# EAGLE design pcbmlf (EAGLE 9.6.2)
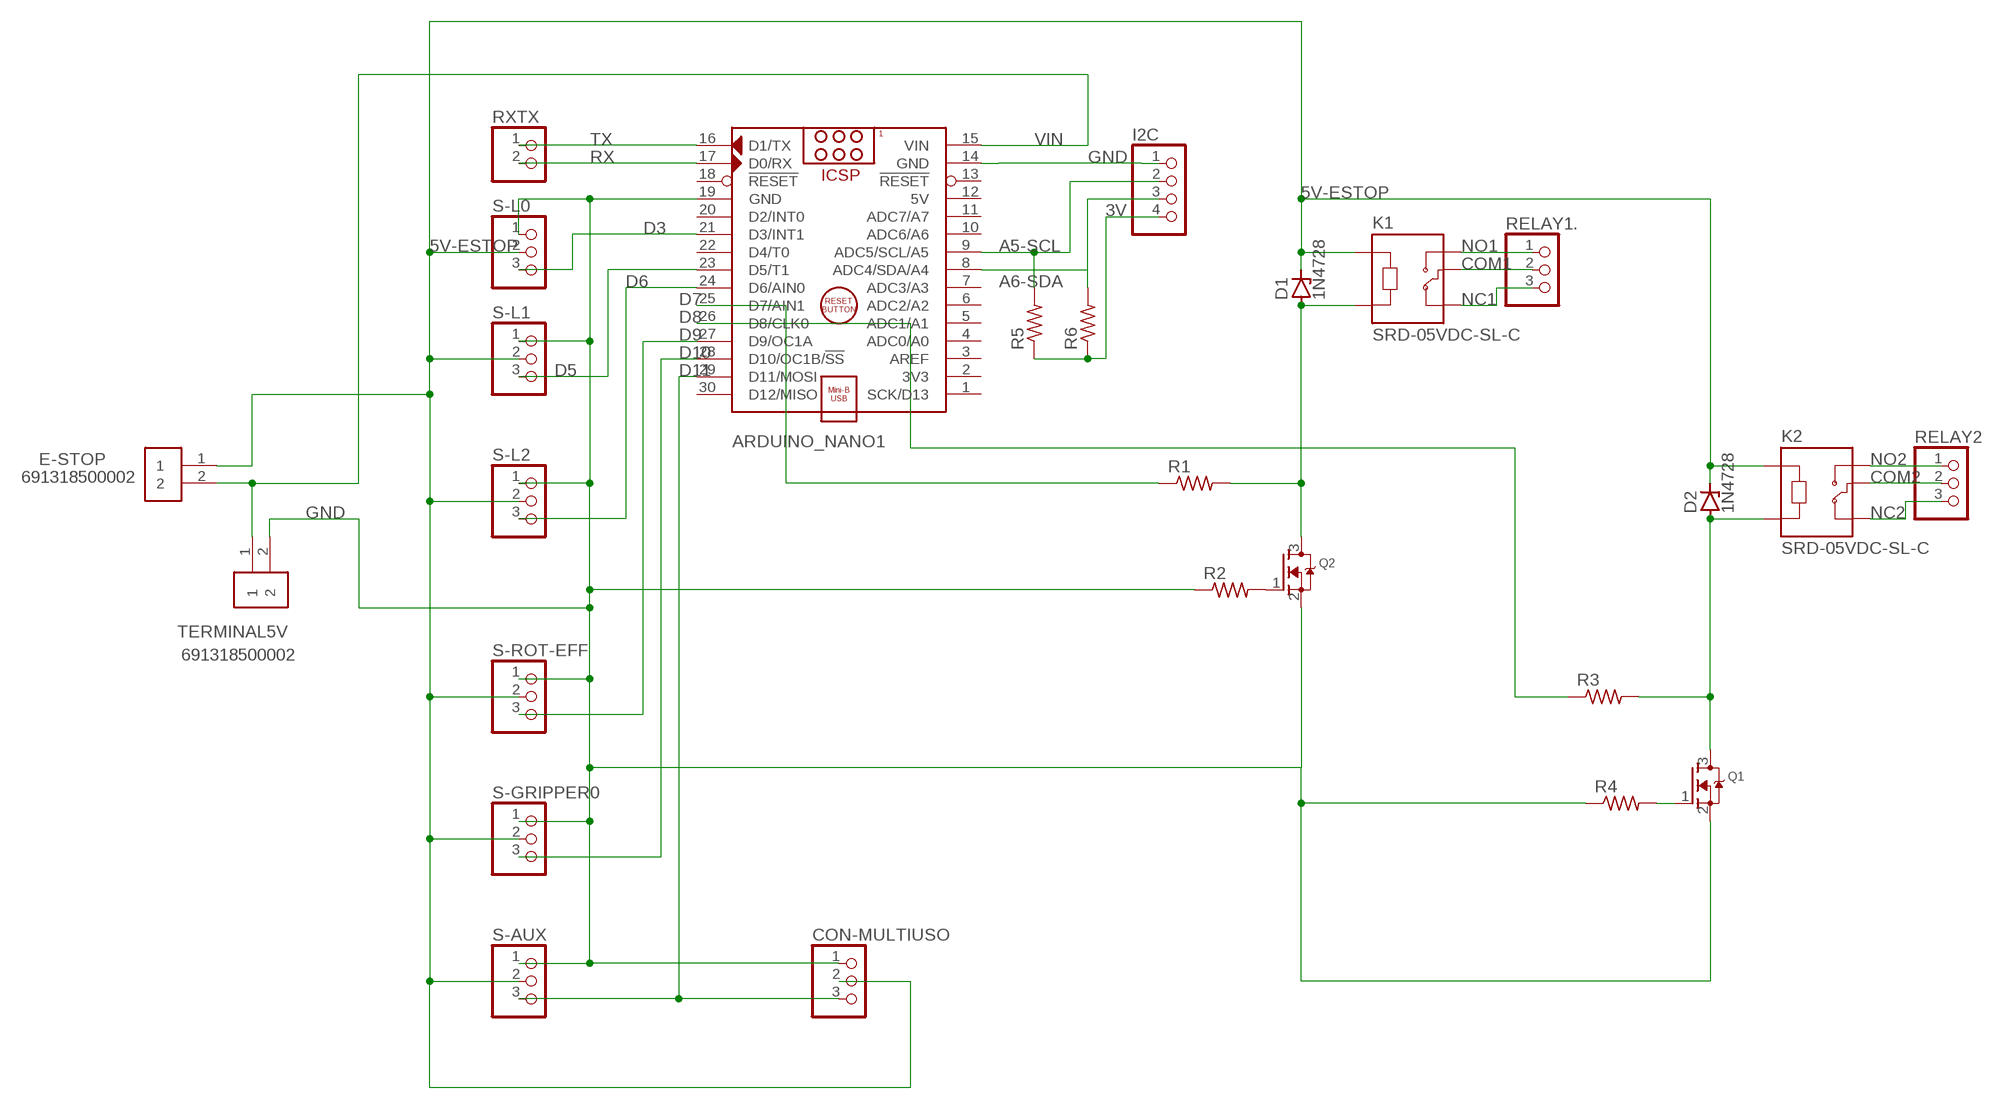
[diagram p0: schematic, sheet 1]

## Parts
ARDUINO_NANO1  ARDUINO_NANO  [ARDUINO_NANO]
CON-MULTIUSO  PINHD-1X3  [1X03]
D1  1N4728  [DO41Z10]
D2  1N4728  [DO41Z10]
E-STOP  691318500002  [TERMINALBLOCK_PLUGGABLE-2-5.08MM]
I2C  PINHD-1X4  [1X04]
K1  SRD-05VDC-SL-C  [RELAY_SRD-05VDC-SL-C]
K2  SRD-05VDC-SL-C  [RELAY_SRD-05VDC-SL-C]
Q1  MOSFET-NWAVE  [SOT23-W]
Q2  MOSFET-NWAVE  [SOT23-W]
R1  R-US_R0805  [R0805]
R2  R-US_R0805  [R0805]
R3  R-US_R0805  [R0805]
R4  R-US_R0805  [R0805]
R5  R-US_R0805  [R0805]
R6  R-US_R0805  [R0805]
RELAY1.  PINHD-1X3  [1X03]
RELAY2  PINHD-1X3  [1X03]
RXTX  PINHD-1X2  [1X02]
S-AUX  PINHD-1X3  [1X03]
S-GRIPPER0  PINHD-1X3  [1X03]
S-L0  PINHD-1X3  [1X03]
S-L1  PINHD-1X3  [1X03]
S-L2  PINHD-1X3  [1X03]
S-ROT-EFF  PINHD-1X3  [1X03]
TERMINAL5V  691318500002  [TERMINALBLOCK_PLUGGABLE-2-5.08MM]

## Nets
3V: I2C.4 R5.1 R6.1
5V-ESTOP: CON-MULTIUSO.2 D1.C D2.C E-STOP.1 K1.A1 K2.A1 S-AUX.2 S-GRIPPER0.2 S-L0.2 S-L1.2 S-L2.2 S-ROT-EFF.2
A5-SCL: ARDUINO_NANO1.9(ADC5/SCL/A5) I2C.2 R5.2
A6-SDA: ARDUINO_NANO1.8(ADC4/SDA/A4) I2C.3 R6.2
COM1: K1.COM RELAY1..2
COM2: K2.COM RELAY2.2
D3: ARDUINO_NANO1.21(D3/INT1) S-L0.3
D5: ARDUINO_NANO1.23(D5/T1) S-L1.3
D6: ARDUINO_NANO1.24(D6/AIN0) S-L2.3
D7: ARDUINO_NANO1.25(D7/AIN1) R1.1
D8: ARDUINO_NANO1.26(D8/CLK0) R3.1
D9: ARDUINO_NANO1.27(D9/OC1A) S-ROT-EFF.3
D10: ARDUINO_NANO1.28(D10/OC1B/!SS) S-GRIPPER0.3
D11: ARDUINO_NANO1.29(D11/MOSI) CON-MULTIUSO.3 S-AUX.3
GND: ARDUINO_NANO1.14(GND) ARDUINO_NANO1.19(GND) CON-MULTIUSO.1 I2C.1 Q1.2(S) Q2.2(S) R2.1 R4.1 S-AUX.1 S-GRIPPER0.1 S-L0.1 S-L1.1 S-L2.1 S-ROT-EFF.1 TERMINAL5V.2
N$8: Q2.1(G) R2.2
N$12: Q1.1(G) R4.2
N$13: D1.A K1.A2 Q2.3(D) R1.2
N$14: D2.A K2.A2 Q1.3(D) R3.2
NC1: K1.NC RELAY1..3
NC2: K2.NC RELAY2.3
NO1: K1.NO RELAY1..1
NO2: K2.NO RELAY2.1
RX: ARDUINO_NANO1.17(D0/RX) RXTX.2
TX: ARDUINO_NANO1.16(D1/TX) RXTX.1
VIN: ARDUINO_NANO1.15(VIN) E-STOP.2 TERMINAL5V.1
Unconnected: ARDUINO_NANO1.1(SCK/D13) ARDUINO_NANO1.2(3V3) ARDUINO_NANO1.3(AREF) ARDUINO_NANO1.4(ADC0/A0) ARDUINO_NANO1.5(ADC1/A1) ARDUINO_NANO1.6(ADC2/A2) ARDUINO_NANO1.7(ADC3/A3) ARDUINO_NANO1.10(ADC6/A6) ARDUINO_NANO1.11(ADC7/A7) ARDUINO_NANO1.13(!RESET) ARDUINO_NANO1.18(!RESET) ARDUINO_NANO1.20(D2/INT0) ARDUINO_NANO1.22(D4/T0) ARDUINO_NANO1.30(D12/MISO)

## Power pins joined to a net without a drawn wire
5V: ARDUINO_NANO1.12(5V)

## Library data of the parts
ARDUINO_NANO1 = ArduinoNanoV30:ARDUINO_NANO: Arduino Nano V3.0 Module Overview: The Arduino Nano is a small, complete, and breadboard-friendly board based on the ATmega328 (Arduino Nano 3.x) or ATmega168 (Arduino Nano 2.x). It has more or less the same functionality of the Arduino Duemilanove, but in a different package. It lacks only a DC power jack, and works with a Mini-B USB cable instead of a standard one. The Nano was designed and is being produced by Gravitech <http://www.gravitech.us/arna30wiatp.html>. General specifications: Item Value Microcontroller Atmel ATmega168 or ATmega328 Operating Voltage (logic level) 5 V Input Voltage (recommended) 7-12 V Input Voltage (limits) 6-20 V Digital I/O Pins 14 (of which 6 provide PWM output) Analog Input Pins 8 DC Current per I/O Pin 40 mA Flash Memory 16 KB (ATmega168) or 32 KB (ATmega328) of which 2 KB used by bootloader SRAM 1 KB (ATmega168) or 2 KB (ATmega328) EEPROM 512 bytes (ATmega168) or 1 KB (ATmega328) Clock Speed 16 MHz Dimensions (Inches) 0.73" x 1.70" Dimensions (mm) 18mm x 45mm Overall height About 9 mm (not including pins) Weigth 5 g Power: The Arduino Nano can be powered via the Mini-B USB connection, 6-20V unregulated external power supply (pin 30), or 5V regulated external power supply (pin 27). The power source is automatically selected to the highest voltage source. Memory: The ATmega168 has 16 KB of flash memory for storing code (of which 2 KB is used for the bootloader); the ATmega328 has 32 KB, (also with 2 KB used for the bootloader). The ATmega168 has 1 KB of SRAM and 512 bytes of EEPROM (which can be read and written with the EEPROM library); the ATmega328 has 2 KB of SRAM and 1 KB of EEPROM. Input and Output: Each of the 14 digital pins on the Nano can be used as an input or output, using pinMode(), digitalWrite(), and digitalRead() functions. They operate at 5 volts. Each pin can provide or receive a maximum of 40 mA and has an internal pull-up resistor (disconnected by default) of 20-50 kOhms. In addition, some pins have specialized functions. Visit Arduino - ArduinoBoardNano <https://www.arduino.cc/en/Main/ArduinoBoardNano>
CON-MULTIUSO RELAY1. RELAY2 S-AUX S-GRIPPER0 S-L0 S-L1 S-L2 S-ROT-EFF = pinhead:PINHD-1X3: PIN HEADER
D1 D2 = diode:1N4728: Z DIODE 3.3 V, 1W, 5 percent
E-STOP TERMINAL5V = Terminal Blocks:691318500002: 5.08MM CLOSE VERTICAL PCB HEADER WITH FLANGES WR-TBL Manufacturer's datasheet <https://katalog.we-online.com/em/datasheet/6913185000xx.pdf>; CREATED_BY: PCBLayout.com; MANUFACTURER: WURTH ELEKTRONIK; MPN: 691318500002
I2C = pinhead:PINHD-1X4: PIN HEADER
K1 = SRD-05VDC-SL-C:SRD-05VDC-SL-C: 5V Trigger Relay Module For Arduino And Raspberry Pi 5V Trigger Relay Module For Arduino And Raspberry Pi Check availability <https://pricing.snapeda.com/parts/SRD-05VDC-SL-C/Songle%20Relay/view-part?ref=eda>; AVAILABILITY: Not in stock; DESCRIPTION: 5V Trigger Relay Module For Arduino And Raspberry Pi 5V Trigger Relay Module For Arduino And Raspberry Pi; MF: Songle Relay; MP: SRD-05VDC-SL-C; PACKAGE: NON STANDARD-5 Songle Relay; PRICE: None
K2 = SRD-05VDC-SL-C:SRD-05VDC-SL-C: 5V Trigger Relay Module For Arduino And Raspberry Pi 5V Trigger Relay Module For Arduino And Raspberry Pi Check availability <https://pricing.snapeda.com/parts/SRD-05VDC-SL-C/Songle%20Relay/view-part?ref=eda>; AVAILABILITY: Not in stock; DESCRIPTION: 5V Trigger Relay Module For Arduino And Raspberry Pi 5V Trigger Relay Module For Arduino And Raspberry Pi; MF: Songle Relay; MP: SRD-05VDC-SL-C; PACKAGE: NON STANDARD-5 Songle Relay; PRICE: None; SPICEPREFIX: X
Q1 Q2 = adafruit:MOSFET-N: N-Channel Mosfet 2N7002E - 60V 260mA SOT23 [Digikey: 2N7002ET1GOSTR-ND] - REEL BSH103 - 30V 850mA SOT23 [Digikey: 568-5013-1-ND]
R1-R6 = rcl:R-US_: RESISTOR, American symbol; SPICEPREFIX: R
RXTX = pinhead:PINHD-1X2: PIN HEADER

## Net classes
0 default: width 0.508 mm

## Board
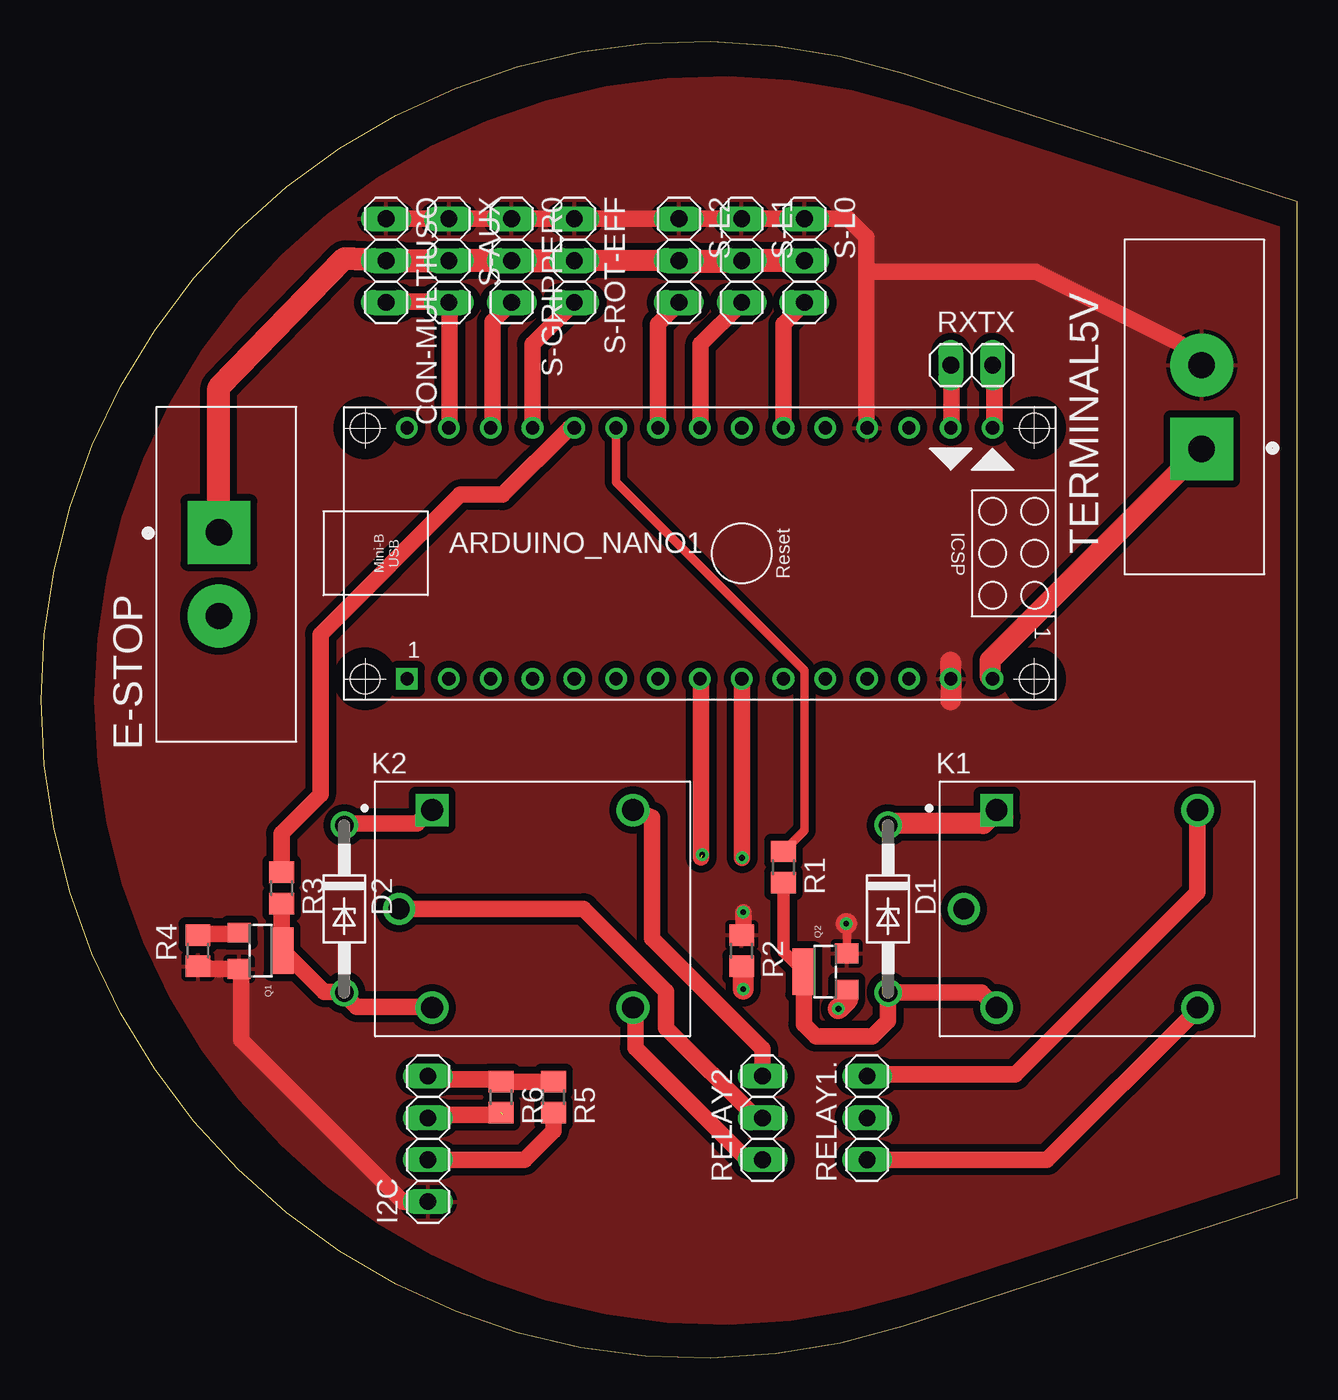
[diagram p1: board, top side]
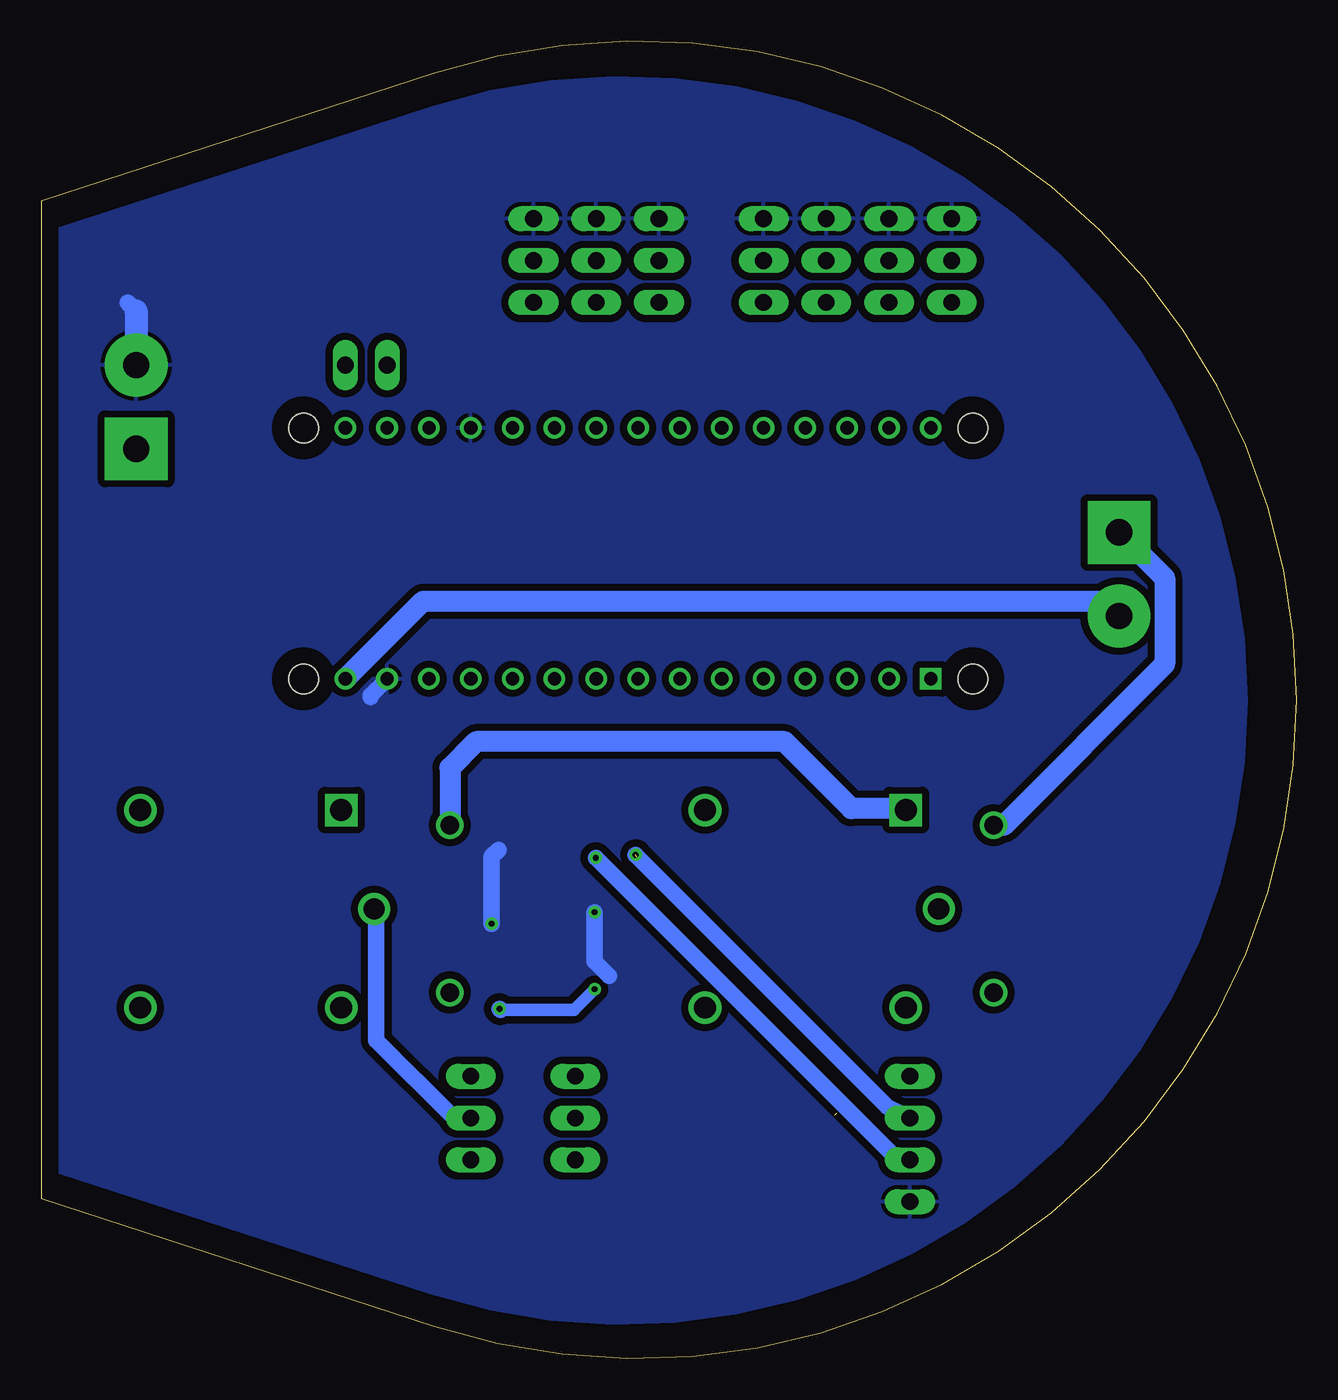
[diagram p2: board, bottom side, seen from below]

Size 76.25 x 79.99 mm. Coordinates in mm from the lower left corner, seen from the top.
Outline: 52.36,78.04 76.25,70.27 76.25,9.71 52.36,1.95 arc-216 52.36,78.04
Copper layers (1*16): Top 0.035mm / dielectric 1.5mm / Bottom 0.035mm
Design rules "default *": minimum track width 20mil, minimum drill 0.35mm, track to track 6mil, track to pad 6mil, pad to pad 6mil, via to via 6mil, smd to smd 6mil, copper to edge 40mil, drill to drill 6mil, minimum pad ring 10mil, minimum via ring 8mil, stop-mask expansion 4mil, vias tented up to drill 0mil, thermal gap 10mil

### Footprints (pad centres in the part's own frame; a part is rotated, then mirrored left to right if it is on the bottom)
ARDUINO_NANO = drill 0.8 square: 1 -20.32,-7.62 | drill 0.8: 2 -17.78,-7.62; 3 -15.24,-7.62; 4 -12.7,-7.62; 5 -10.16,-7.62; 6 -7.62,-7.62; 7 -5.08,-7.62; 8 -2.54,-7.62; 9 0,-7.62; 10 2.54,-7.62; 11 5.08,-7.62; 12 7.62,-7.62; 13 10.16,-7.62; 14 12.7,-7.62; 15 15.24,-7.62; 16 15.24,7.62; 17 12.7,7.62; 18 10.16,7.62; 19 7.62,7.62; 20 5.08,7.62; 21 2.54,7.62; 22 0,7.62; 23 -2.54,7.62; 24 -5.08,7.62; 25 -7.62,7.62; 26 -10.16,7.62; 27 -12.7,7.62; 28 -15.24,7.62; 29 -17.78,7.62; 30 -20.32,7.62 | hole 1.778: -22.86,-7.62; -22.86,7.62; 17.78,7.62; 17.78,-7.62
1X03 = drill 1.016 long: 1 -2.54,0; 2 0,0; 3 2.54,0
DO41Z10 = drill 1.118: A 5.08,0; C -5.08,0
TERMINALBLOCK_PLUGGABLE-2-5.08MM = drill 1.6 pad 3.81 square: 1 -2.54,0 | drill 1.6 pad 3.81: 2 2.54,0
1X04 = drill 1.016 long: 1 -3.81,0; 2 -1.27,0; 3 1.27,0; 4 3.81,0
RELAY_SRD-05VDC-SL-C = drill 1.32 square: A1 -6.1,6 | drill 1.32: A2 -6.1,-6; NC 6.1,6; NO 6.1,-6 | drill 1.29: COM -8.1,0
SOT23-W = smd 1.2 x 1.4: 1 -1.1,-1.3; 2 1.1,-1.3 | smd 2.8 x 1.4: 3 0,1.3
R0805 = smd 1.3 x 1.5: 1 -0.95,0; 2 0.95,0
1X02 = drill 1.016 long: 1 -1.27,0; 2 1.27,0

### Placement (x,y rotation side)
ARDUINO_NANO1  42.54,48.88 0 top
CON-MULTIUSO  20.95,66.66 270 top
D1  51.43,27.29 270 top
D2  18.41,27.29 270 top
E-STOP  10.79,47.61 270 top
I2C  23.49,13.32 90 top
K1  64.13,27.29 0 top
K2  29.84,27.29 0 top
Q1  13.33,24.75 270 top
Q2  47.62,23.48 90 top
R1  45.08,29.83 270 top
R2  42.54,24.75 270 top
R3  14.6,28.56 270 top
R4  9.52,24.75 90 top
R5  31.11,15.86 270 top
R6  27.94,15.86 270 top
RELAY1.  50.16,14.59 90 top
RELAY2  43.81,14.59 90 top
RXTX  56.51,60.31 180 top
S-AUX  24.76,66.66 270 top
S-GRIPPER0  28.57,66.66 270 top
S-L0  46.35,66.66 270 top
S-L1  42.54,66.66 270 top
S-L2  38.73,66.66 270 top
S-ROT-EFF  32.38,66.66 270 top
TERMINAL5V  70.48,57.77 90 top

### Tracks (layer width: path | path; a pad name or v marks a point on that pad's centre or on a via)
3V
  Top 1.016: R5.1 31.07,16.78 28.04,16.78 28,16.81 R6.1 27.88,16.87 27.88,16.93 23.74,16.93 23.54,17.13 I2C.4
5V-ESTOP
  Top 1.016: 24.81,66.66 S-AUX.2 25.52,66.66 | 39.24,66.41 38.88,66.77 38.68,66.77 | D2.C 18.41,32.48 22.83,32.48 23.59,33.24 23.68,33.24 K2.A1 | 51.53,32.48 D1.C | 58.54,32.88 58.44,32.88 K1.A1 58.13,33.29 | 28.47,66.66 S-GRIPPER0.2 27.55,66.66 | 32.74,66.77 32.48,66.77 S-ROT-EFF.2 32.13,66.66
  Top 1.27: K1.A1 57.21,32.48 51.53,32.48 | S-L1.2 38.78,66.66 | S-L1.2 42.49,66.61 | S-L1.2 34.92,66.66 32.13,66.66 | 32.13,66.66 31.36,66.66 | S-L2.2 38.78,66.66 | 38.78,66.66 38.83,66.61 | 39.75,66.61 39.7,66.66 S-L2.2 | S-L2.2 38.68,66.72 38.68,66.77 | S-ROT-EFF.2 27.55,66.66 | 32.13,66.66 CON-MULTIUSO.2
  Top 1.397: S-AUX.2 CON-MULTIUSO.2 18.41,66.77 10.79,58.94 E-STOP.1 | 27.55,66.66 25.52,66.66 | S-GRIPPER0.2 31.36,66.66 S-ROT-EFF.2 | 42.49,66.61 39.75,66.61 38.83,66.61 | S-L0.2 S-L1.2
  Bottom 0.152: 23.74,33.39 K2.A1
  Bottom 1.016: D2.C 17.8,32.37
  Bottom 1.27: 17.8,32.37 8.02,42.15 8.02,47.39 E-STOP.1 | D1.C 51.43,35.85 49.83,37.45 31.11,37.45 27.05,33.39 23.74,33.39
A5-SCL  (via drill 0.35)
  Top 1.016: R5.2 31.11,13.81 29.36,12.05 I2C.2 | ARDUINO_NANO1.9 42.57,41.24 v42.57,30.39
  Bottom 1.016: v42.57,30.39 24.23,12.05 I2C.2
A6-SDA  (via drill 0.35)  (2 unrouted)
  Top 1.016: 28.05,14.8 23.74,14.8 23.54,14.59 I2C.3 | ARDUINO_NANO1.8 40.08,41.19 40.08,30.42
  Bottom 1.016: v40.15,30.57 24.86,15.28 I2C.3
COM1
  Bottom 0.152: 55.9,27.29 K1.COM
  Bottom 1.016: RELAY1..2 51.18,14.59 55.9,19.32 55.9,27.29
COM2
  Top 1.016: RELAY2.2 43.43,14.59 37.94,20.08 37.94,22.29 32.94,27.29 K2.COM
D3
  Top 1.016: ARDUINO_NANO1.21 45.08,62.8 46.3,64.02 46.3,64.07 S-L0.3
D5
  Top 1.016: ARDUINO_NANO1.23 40.05,56.56 40.05,61.58 42.49,64.02 42.49,64.07 S-L1.3
D6
  Top 1.016: ARDUINO_NANO1.24 37.46,62.8 38.73,64.07 S-L2.3
D7
  Top 0.508: R1.1 46.35,32.05 46.35,41.77 34.92,53.2 ARDUINO_NANO1.25
D8
  Top 1.016: R3.1 14.6,31.87 16.96,34.23 16.96,43.96 25.45,52.44 28.01,52.44 32.08,56.5 ARDUINO_NANO1.26
D9
  Top 1.016: ARDUINO_NANO1.27 29.84,61.58 S-ROT-EFF.3
D10
  Top 1.016: S-GRIPPER0.3 27.4,62.96 27.4,56.56 27.35,56.56 ARDUINO_NANO1.28
D11
  Top 1.016: ARDUINO_NANO1.29 24.81,56.56 24.81,64.07 S-AUX.3 24.3,64.12 24.25,64.18 21,64.18 CON-MULTIUSO.3
GND  (via drill 0.35)
  Top 0.508: 48.92,26.39 Q2.2
  Top 1.016: CON-MULTIUSO.1 S-AUX.1 S-GRIPPER0.1 S-ROT-EFF.1 S-L2.1 S-L1.1 S-L0.1 48.99,69.2 50.11,68.09 50.11,66 | 50.11,66 50.11,56.56 ARDUINO_NANO1.19 50.26,56.4 | 50.11,66 60.37,66 69.21,61.58 TERMINAL5V.2 | v42.64,27.09 42.64,25.86 42.54,25.76 R2.1 | 23.74,9.62 23.59,9.62 I2C.1 21.97,9.51 12.15,19.33 12.15,23.54 Q1.2 12.14,23.65 12.16,23.64 10.18,23.64 10.01,23.8 R4.1
  Top 1.27: v48.89,26.39 48.92,26.39 | 55.24,39.99 ARDUINO_NANO1.14 55.24,42.28
  Bottom 1.016: v48.89,26.39 48.89,30.47 48.48,30.88 | ARDUINO_NANO1.14 56.26,40.25 56.26,40.16 | 70.48,63.62 70.99,64.12 | v42.64,27.09 42.64,24.09 41.78,23.23
  Bottom 1.397: 70.48,63.62 TERMINAL5V.2
  pour Top (isolate 0.432, rank 2): 75.74,11.33 52.87,3.9 arc-216 52.87,76.02 75.74,68.59
  pour Bottom (isolate 0.432, rank 2): 75.23,11.24 52.61,3.9 arc-216 52.61,76.02 75.23,68.67
N$8  (via drill 0.35)
  Top 1.016: 48.99,22.31 Q2.1
  Top 1.27: v48.41,21.23 48.99,21.81 48.99,22.31 | R2.2 42.64,23.7 v42.64,22.42
  Bottom 0.762: 48.36,21.17 43.89,21.17 v42.64,22.42
  Bottom 1.016: v48.41,21.23 48.36,21.17
N$12
  Top 1.016: R4.2 9.52,25.72 9.57,25.77 12.01,25.77 12.03,25.79 Q1.1
N$13
  Top 0.762: 46.3,23.48 45.08,24.7 R1.2
  Top 1.016: K1.A2 57.11,22.21 D1.A 51.43,20.5 50.48,19.55 47.05,19.55 46.32,20.28 Q2.3 46.3,23.48
N$14
  Top 1.016: R3.2 14.6,24.78 Q1.3 14.7,24.75 17.19,22.27 18.41,22.27 D2.A 18.41,22.11 19.17,21.35 23.59,21.35 23.65,21.29 K2.A2
NC1
  Top 1.016: 49.65,17.13 RELAY1..3 50.26,17.24 59.18,17.24 70.23,28.29 70.23,33.24 K1.NC
NC2
  Top 1.016: RELAY2.3 43.81,18.79 37.1,25.49 37.1,32.85 K2.NC
NO1
  Top 1.016: RELAY1..1 61.08,12.05 70.23,21.2 K1.NO
NO2
  Top 1.016: RELAY2.1 42.9,12.05 36.09,18.86 36.09,21.2 K2.NO
RX
  Top 1.016: ARDUINO_NANO1.17 55.29,56.56 55.29,60.26 RXTX.2
TX
  Top 1.016: ARDUINO_NANO1.16 57.83,56.56 57.88,56.56 57.88,60.21 RXTX.1
VIN
  Top 1.016: TERMINAL5V.1 70.48,56 69.72,56 TERMINAL5V.1
  Top 1.27: ARDUINO_NANO1.15 57.63,41.42 57.63,42.38 TERMINAL5V.1
  Bottom 1.27: E-STOP.2 11.7,45.99 53.06,45.99 ARDUINO_NANO1.15